# EAGLE schematic main (EAGLE 5.11)
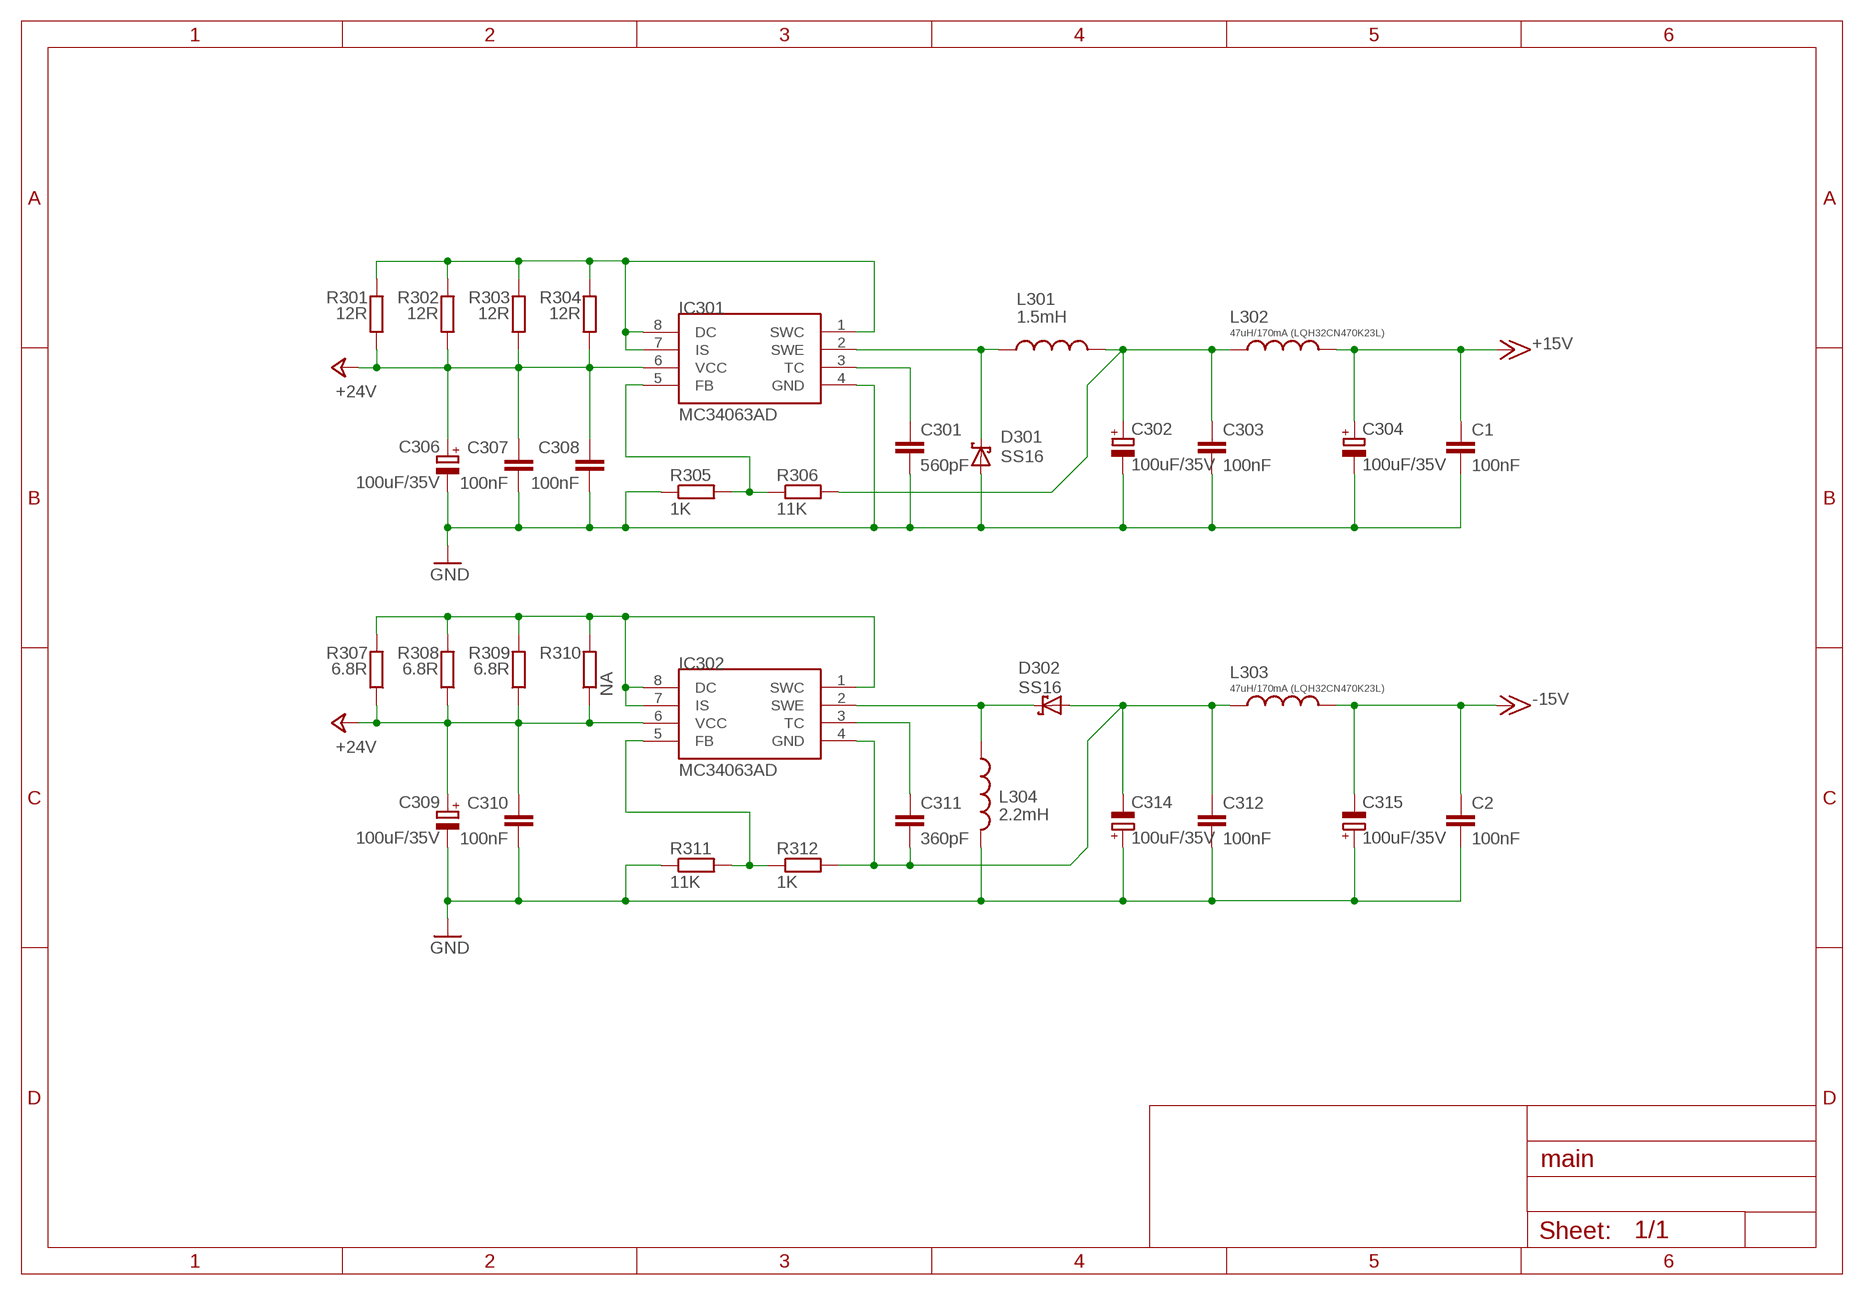
[diagram p0: schematic, sheet 1]

## Parts
C1  100nF  C-EUC0603  [C0603]
C2  100nF  C-EUC0603  [C0603]
C301  560pF  C-EUC0603  [C0603]
C302  100uF/35V  CPOL-EUE3.5-8  [E3,5-8]
C303  100nF  C-EUC0603  [C0603]
C304  100uF/35V  CPOL-EUE3.5-8  [E3,5-8]
C306  100uF/35V  CPOL-EUE3.5-8  [E3,5-8]
C307  100nF  C-EUC0603  [C0603]
C308  100nF  C-EUC0603  [C0603]
C309  100uF/35V  CPOL-EUE3.5-8  [E3,5-8]
C310  100nF  C-EUC0603  [C0603]
C311  360pF  C-EUC0603  [C0603]
C312  100nF  C-EUC0603  [C0603]
C314  100uF/35V  CPOL-EUE3.5-8  [E3,5-8]
C315  100uF/35V  CPOL-EUE3.5-8  [E3,5-8]
D301  SS16  1N581SMD  [DO214AC]
D302  SS16  1N581SMD  [DO214AC]
IC301  MC34063AD  [SOIC8]
IC302  MC34063AD  [SOIC8]
L301  1.5mH  L-USSW68-V  [CW68-V]
L302  47uH/170mA (LQH32CN470K23L)  L-USL2825P  [L2825P]
L303  47uH/170mA (LQH32CN470K23L)  L-USL2825P  [L2825P]
L304  2.2mH  L-USSW68-V  [CW68-V]
R301  12R  R-EU_R0603  [R0603]
R302  12R  R-EU_R0603  [R0603]
R303  12R  R-EU_R0603  [R0603]
R304  12R  R-EU_R0603  [R0603]
R305  1K  R-EU_R0603  [R0603]
R306  11K  R-EU_R0603  [R0603]
R307  6.8R  R-EU_R0603  [R0603]
R308  6.8R  R-EU_R0603  [R0603]
R309  6.8R  R-EU_R0603  [R0603]
R310  NA  R-EU_R0603  [R0603]
R311  11K  R-EU_R0603  [R0603]
R312  1K  R-EU_R0603  [R0603]

## Nets
15V+: C302.+ C303.1 L301.P$2 L302.1 R306.2
15V-: C311.2 C312.1 C314.- D302.A IC302.4(GND) L303.1 R312.2
+15V: C1.1 C304.+ L302.2
+24V: C306.+ C307.1 C308.1 C309.+ C310.1 IC301.6(VCC) IC302.6(VCC) R301.1 R302.1 R303.1 R304.1 R307.1 R308.1 R309.1 R310.1
-15V: C2.1 C315.- L303.2
GND: C1.2 C2.2 C301.2 C302.- C303.2 C304.- C306.- C307.2 C308.2 C309.- C310.2 C312.2 C314.+ C315.+ D301.A IC301.4(GND) L304.P$1 R305.1 R311.1
N$84: D301.C IC301.2(SWE) L301.P$1
N$85: IC301.1(SWC) IC301.7(IS) IC301.8(DC) R301.2 R302.2 R303.2 R304.2
N$86: C301.1 IC301.3(TC)
N$87: C311.1 IC302.3(TC)
N$89: IC302.1(SWC) IC302.7(IS) IC302.8(DC) R307.2 R308.2 R309.2 R310.2
N$91: D302.C IC302.2(SWE) L304.P$2
N$93: IC302.5(FB) R311.2 R312.1
N$94: IC301.5(FB) R305.2 R306.1

## Library data of the parts
C1 C2 C301 C303 C307 C308 C310-C312 = rcl:C-EU: CAPACITOR, European symbol
C302 C304 C306 C309 C314 C315 = rcl:CPOL-EU: POLARIZED CAPACITOR, European symbol
D301 D302 = diode:1N581*: 1.0A SCHOTTKY BARRIER RECTIFIER Source: http://www.diodes.com/datasheets/ds23001.pdf
IC301 IC302 = mc34063:MC34063
L301-L304 = rcl:L-US: INDUCTOR, American symbol
R301-R312 = rcl:R-EU_: RESISTOR, European symbol